# Altium schematic sheet panel7.SchDoc
size A
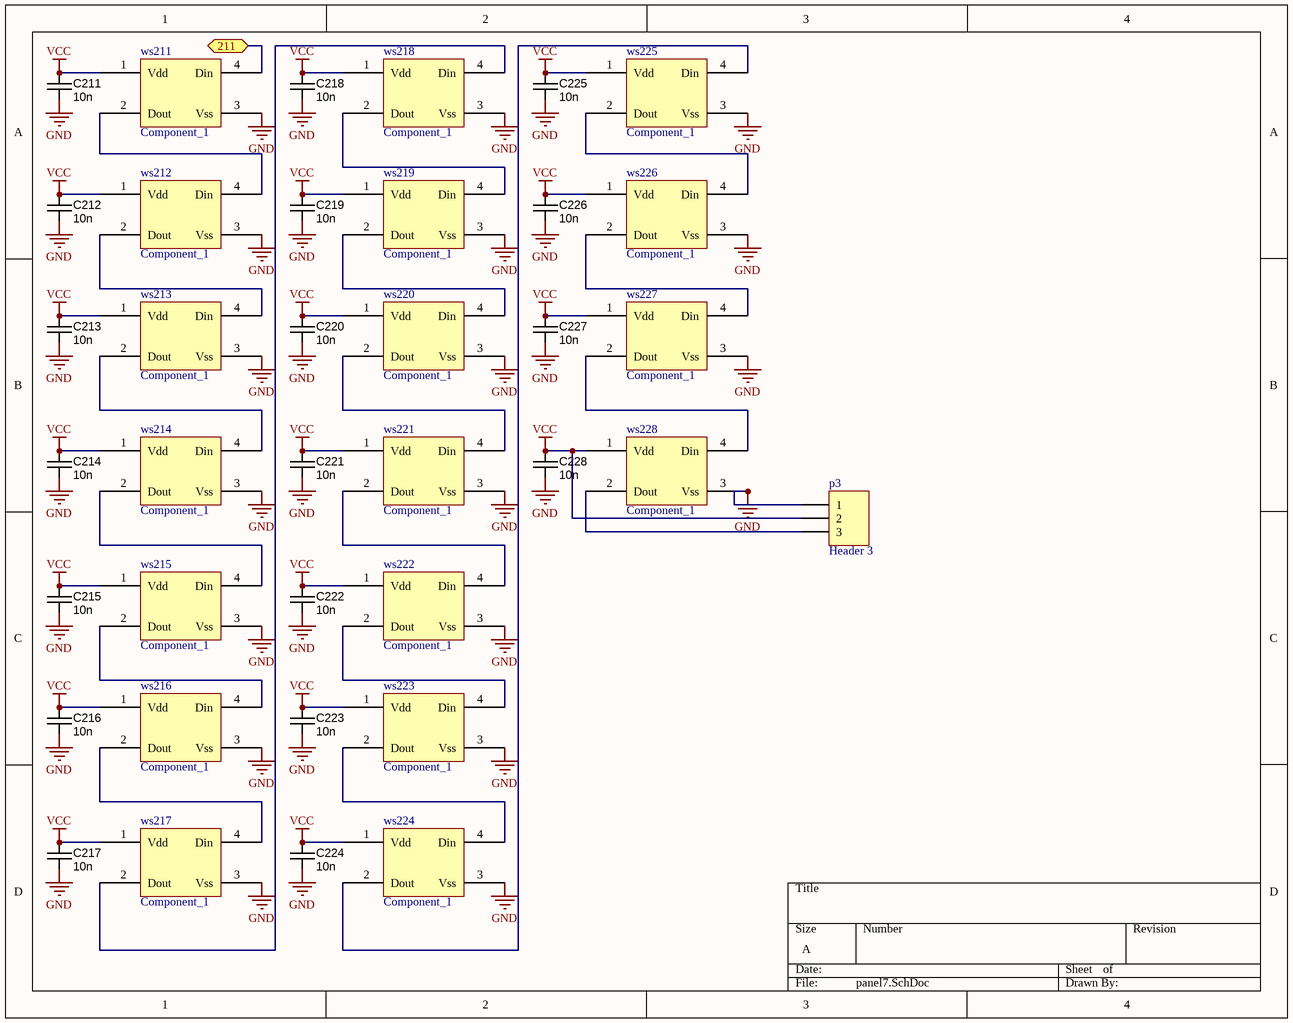
[diagram p0: panel7.SchDoc]

## Parts
C211  value 10n  [CAPC1608X90N]  (hidden comment: approved sub OK)
C212  value 10n  [CAPC1608X90N]  (hidden comment: approved sub OK)
C213  value 10n  [CAPC1608X90N]  (hidden comment: approved sub OK)
C214  value 10n  [CAPC1608X90N]  (hidden comment: approved sub OK)
C215  value 10n  [CAPC1608X90N]  (hidden comment: approved sub OK)
C216  value 10n  [CAPC1608X90N]  (hidden comment: approved sub OK)
C217  value 10n  [CAPC1608X90N]  (hidden comment: approved sub OK)
C218  value 10n  [CAPC1608X90N]  (hidden comment: approved sub OK)
C219  value 10n  [CAPC1608X90N]  (hidden comment: approved sub OK)
C220  value 10n  [CAPC1608X90N]  (hidden comment: approved sub OK)
C221  value 10n  [CAPC1608X90N]  (hidden comment: approved sub OK)
C222  value 10n  [CAPC1608X90N]  (hidden comment: approved sub OK)
C223  value 10n  [CAPC1608X90N]  (hidden comment: approved sub OK)
C224  value 10n  [CAPC1608X90N]  (hidden comment: approved sub OK)
C225  value 10n  [CAPC1608X90N]  (hidden comment: approved sub OK)
C226  value 10n  [CAPC1608X90N]  (hidden comment: approved sub OK)
C227  value 10n  [CAPC1608X90N]  (hidden comment: approved sub OK)
C228  value 10n  [CAPC1608X90N]  (hidden comment: approved sub OK)
p3  Header 3  [HDR1X3]
ws211  Component_1  [SOP4]
ws212  Component_1  [SOP4]
ws213  Component_1  [SOP4]
ws214  Component_1  [SOP4]
ws215  Component_1  [SOP4]
ws216  Component_1  [SOP4]
ws217  Component_1  [SOP4]
ws218  Component_1  [SOP4]
ws219  Component_1  [SOP4]
ws220  Component_1  [SOP4]
ws221  Component_1  [SOP4]
ws222  Component_1  [SOP4]
ws223  Component_1  [SOP4]
ws224  Component_1  [SOP4]
ws225  Component_1  [SOP4]
ws226  Component_1  [SOP4]
ws227  Component_1  [SOP4]
ws228  Component_1  [SOP4]

## Ports
211

## Nets
GND: C211.2 C212.2 C213.2 C214.2 C215.2 C216.2 C217.2 C218.2 C219.2 C220.2 C221.2 C222.2 C223.2 C224.2 C225.2 C226.2 C227.2 C228.2 p3.1 ws211.3(Vss) ws212.3(Vss) ws213.3(Vss) ws214.3(Vss) ws215.3(Vss) ws216.3(Vss) ws217.3(Vss) ws218.3(Vss) ws219.3(Vss) ws220.3(Vss) ws221.3(Vss) ws222.3(Vss) ws223.3(Vss) ws224.3(Vss) ws225.3(Vss) ws226.3(Vss) ws227.3(Vss) ws228.3(Vss)
VCC: C211.1 C212.1 C213.1 C214.1 C215.1 C216.1 C217.1 C218.1 C219.1 C220.1 C221.1 C222.1 C223.1 C224.1 C225.1 C226.1 C227.1 C228.1 p3.2 ws211.1(Vdd) ws212.1(Vdd) ws213.1(Vdd) ws214.1(Vdd) ws215.1(Vdd) ws216.1(Vdd) ws217.1(Vdd) ws218.1(Vdd) ws219.1(Vdd) ws220.1(Vdd) ws221.1(Vdd) ws222.1(Vdd) ws223.1(Vdd) ws224.1(Vdd) ws225.1(Vdd) ws226.1(Vdd) ws227.1(Vdd) ws228.1(Vdd)
211: ws211.4(Din) ; port 211
Netp3_3: p3.3 ws228.2(Dout)
Netws211_2: ws211.2(Dout) ws212.4(Din)
Netws212_2: ws212.2(Dout) ws213.4(Din)
Netws213_2: ws213.2(Dout) ws214.4(Din)
Netws214_2: ws214.2(Dout) ws215.4(Din)
Netws215_2: ws215.2(Dout) ws216.4(Din)
Netws216_2: ws216.2(Dout) ws217.4(Din)
Netws217_2: ws217.2(Dout) ws218.4(Din)
Netws218_2: ws218.2(Dout) ws219.4(Din)
Netws219_2: ws219.2(Dout) ws220.4(Din)
Netws220_2: ws220.2(Dout) ws221.4(Din)
Netws221_2: ws221.2(Dout) ws222.4(Din)
Netws222_2: ws222.2(Dout) ws223.4(Din)
Netws223_2: ws223.2(Dout) ws224.4(Din)
Netws224_2: ws224.2(Dout) ws225.4(Din)
Netws225_2: ws225.2(Dout) ws226.4(Din)
Netws226_2: ws226.2(Dout) ws227.4(Din)
Netws227_2: ws227.2(Dout) ws228.4(Din)

## Library data of the parts
C211-C228 = CAPC_10n_0603_X7R_100V_10%: Capacitor SMD Cer 10nF 10% 100V X7R 0603; Manufacturer: Murata Electronics North America; Manufacturer Part Number: GCM188R72A103KA37D; Ratings: 100V; X7R; Material: ceramic; SCDType: undef; Package / Case: 0603 (1608 metric); Tolerance: ±10%; Supplier 1: Digi-Key; Supplier Part Number 1: 490-4781-1-ND
p3 = Header 3: Header, 3-Pin; LatestRevisionDate: 17-Jul-2002; LatestRevisionNote: Re-released for DXP Platform.; Publisher: Altium Limited